# EAGLE board eib-128-256-nanoz-adapter (EAGLE 8.3.2), part 1 of 2
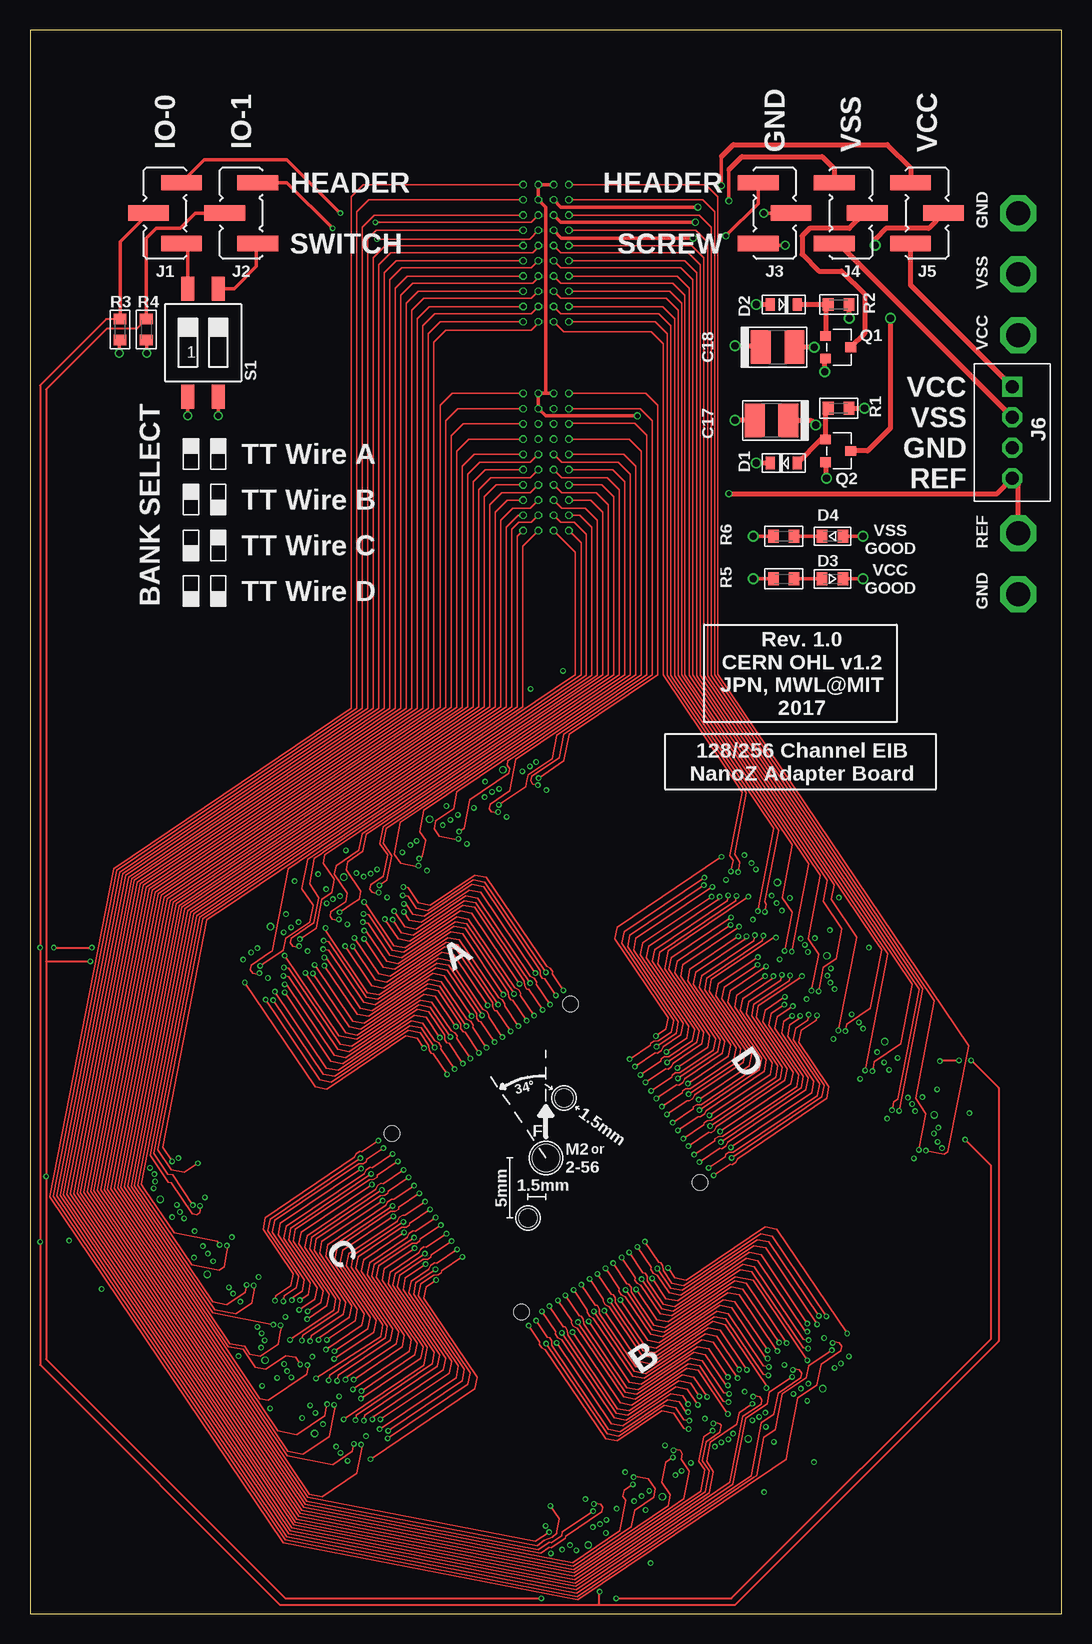
[diagram p5: board, top side]
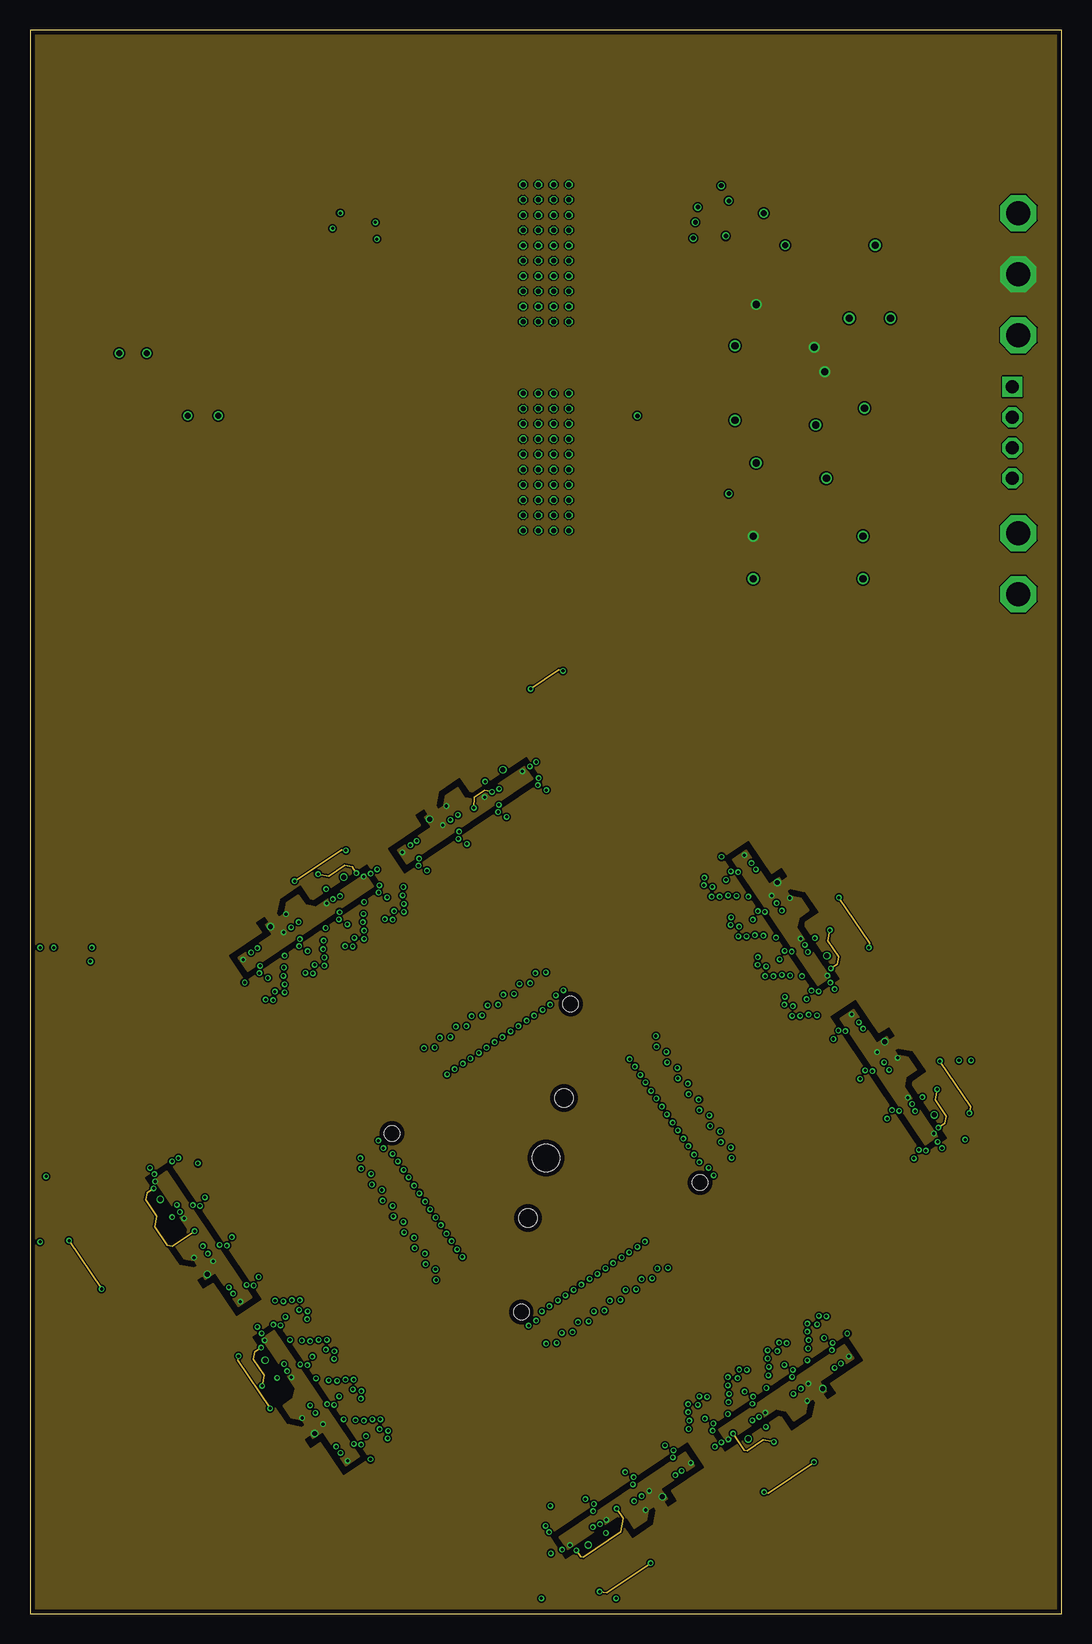
[diagram p6: board, inner layer Route2]
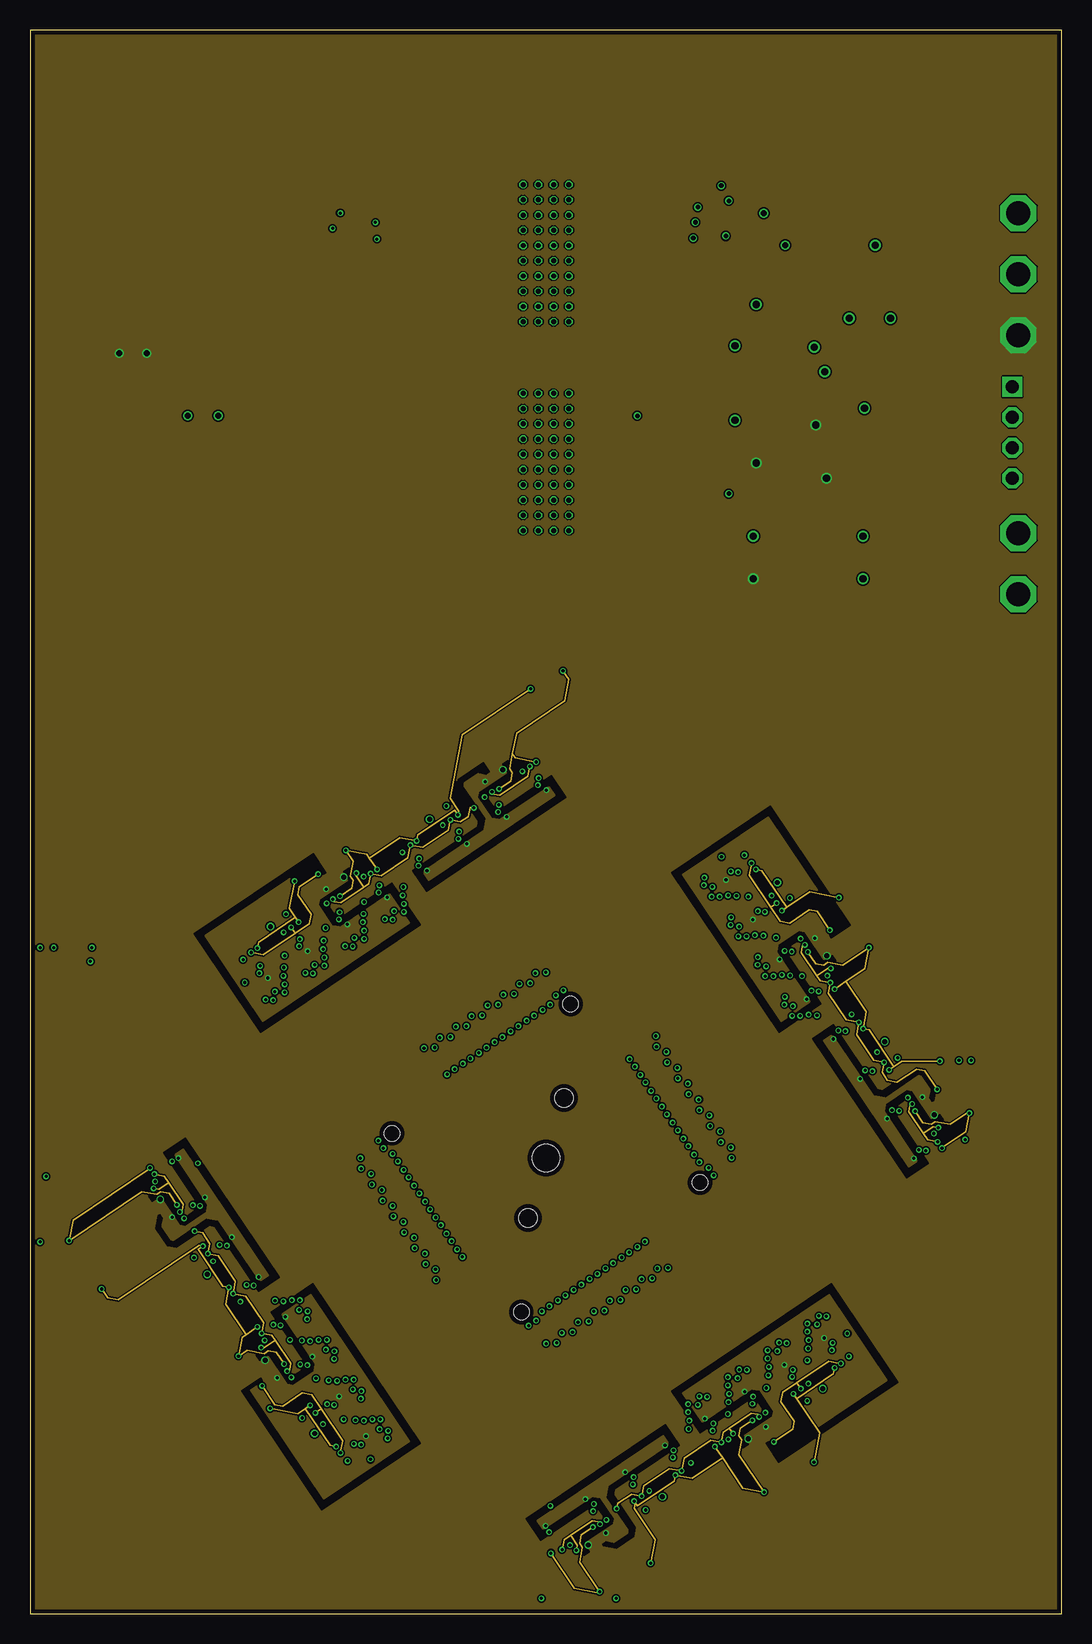
[diagram p7: board, inner layer Route15]
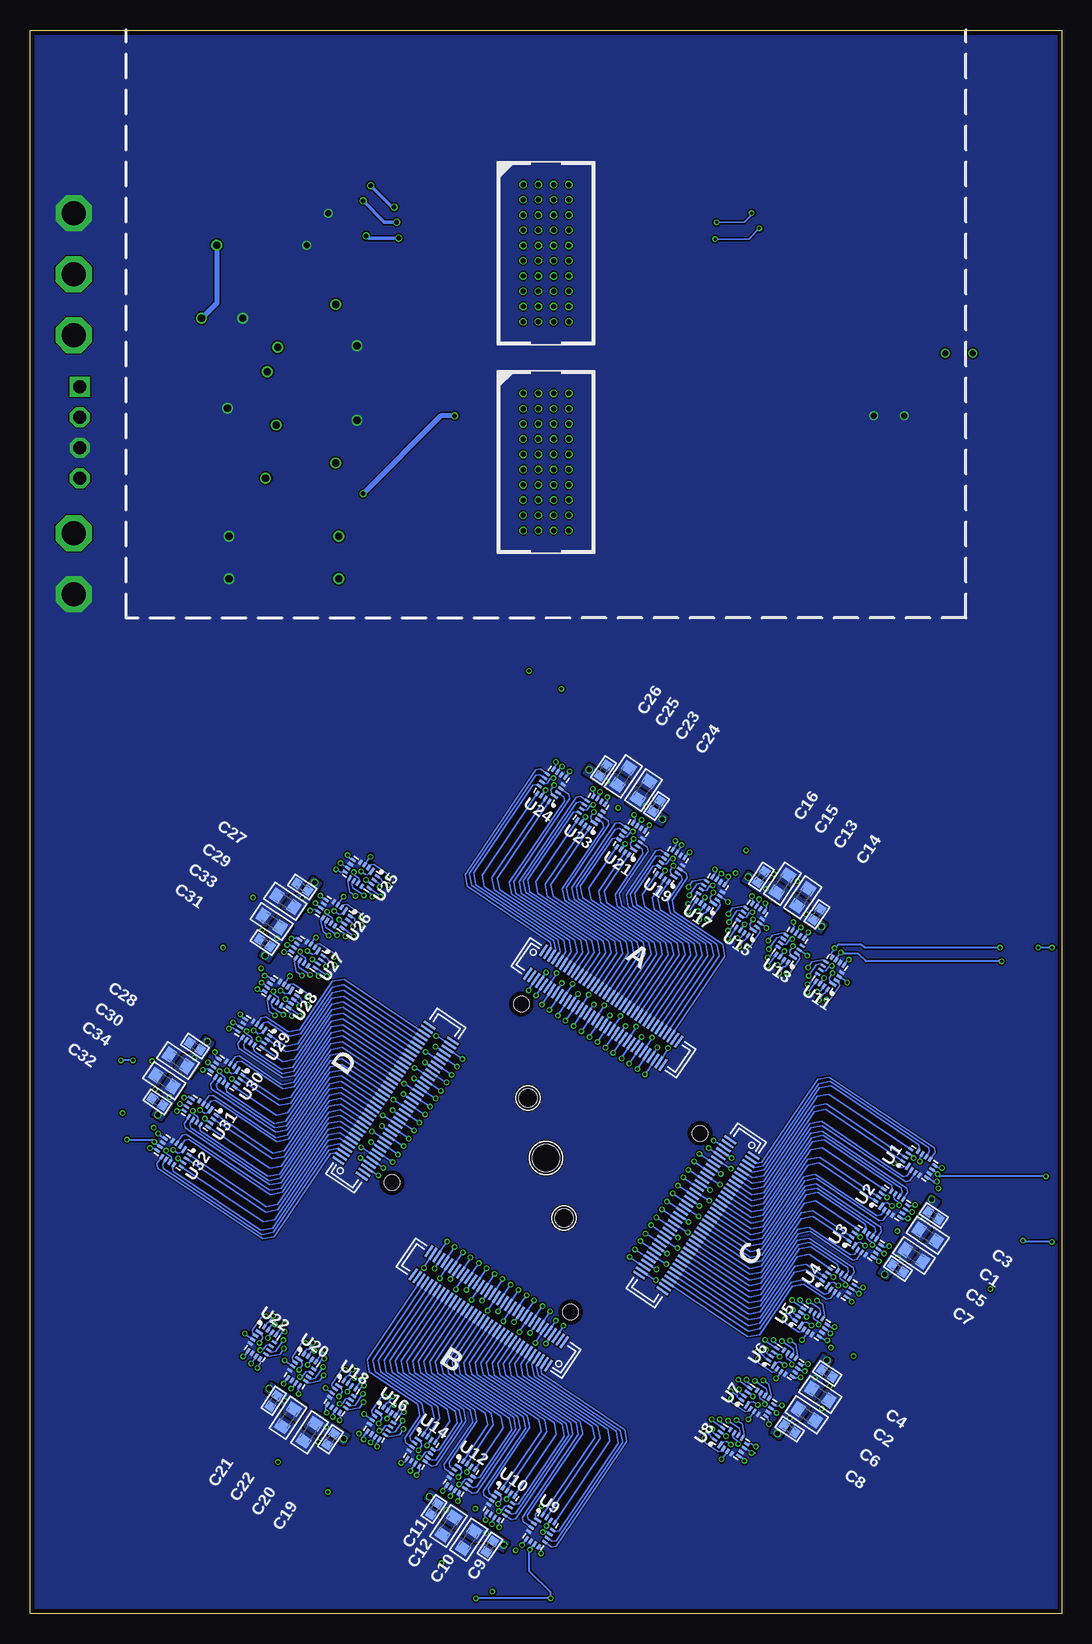
[diagram p8: board, bottom side, seen from below]

Size 86 x 132 mm. Coordinates in mm from the lower left corner, seen from the top.
Outline: 0,0 86,0 86,132 0,132 0,0
Copper layers (1*2*15*16): Top 0.035559375mm / dielectric 0.17018125mm / Route2 0.01778125mm / dielectric 47mil / Route15 0.01778125mm / dielectric 0.17018125mm / Bottom 0.035559375mm
Design rules "ohs-park-4-layer": minimum track width 5mil, minimum drill 10mil, track to track 0.126490625mm, track to pad 0.126490625mm, pad to pad 0.126490625mm, via to via 0.126490625mm, smd to smd 0.126490625mm, copper to edge 15mil, drill to drill 5mil, minimum pad ring 4mil, minimum via ring 4mil, stop-mask expansion 3mil, vias tented up to drill 100mil, thermal gap 10mil
Net classes: 1 thick: width 0.102 mm
Holes 1.27 mm at 45.06,50.85 55.85,35.94 40.94,25.15 30.15,40.06

## Footprints (pad centres in the part's own frame; a part is rotated, then mirrored left to right if it is on the bottom)
DF40-70REC = smd 0.2 x 1.14: 1 -6.8,1.17; 2 -6.4,1.17; 3 -6,1.17; 4 -5.6,1.17; 5 -5.2,1.17; 6 -4.8,1.17; 7 -4.4,1.17; 8 -4,1.17; 9 -3.6,1.17; 10 -3.2,1.17; 11 -2.8,1.17; 12 -2.4,1.17; 13 -2,1.17; 14 -1.6,1.17; 15 -1.2,1.17; 16 -0.8,1.17; 17 -0.4,1.17; 18 0,1.17; 19 0.4,1.17; 20 0.8,1.17; 21 1.2,1.17; 22 1.6,1.17; 23 2,1.17; 24 2.4,1.17; 25 2.8,1.17; 26 3.2,1.17; 27 3.6,1.17; 28 4,1.17; 29 4.4,1.17; 30 4.8,1.17; 31 5.2,1.17; 32 5.6,1.17; 33 6,1.17; 34 6.4,1.17; 35 6.8,1.17; 36 6.8,-1.17; 37 6.4,-1.17; 38 6,-1.17; 39 5.6,-1.17; 40 5.2,-1.17; 41 4.8,-1.17; 42 4.4,-1.17; 43 4,-1.17; 44 3.6,-1.17; 45 3.2,-1.17; 46 2.8,-1.17; 47 2.4,-1.17; 48 2,-1.17; 49 1.6,-1.17; 50 1.2,-1.17; 51 0.8,-1.17; 52 0.4,-1.17; 53 0,-1.17; 54 -0.4,-1.17; 55 -0.8,-1.17; 56 -1.2,-1.17; 57 -1.6,-1.17; 58 -2,-1.17; 59 -2.4,-1.17; 60 -2.8,-1.17; 61 -3.2,-1.17; 62 -3.6,-1.17; 63 -4,-1.17; 64 -4.4,-1.17; 65 -4.8,-1.17; 66 -5.2,-1.17; 67 -5.6,-1.17; 68 -6,-1.17; 69 -6.4,-1.17; 70 -6.8,-1.17
0603 = smd 0.889 x 1.067: 1 -0.864,0; 2 0.864,0
0402 = smd 0.686 x 0.762: 1 -0.533,0; 2 0.533,0
1210-POL = smd 1.651 x 2.794: + -1.397,0; - 1.397,0
SOD-323 = smd 0.762 x 1.016: A -1.118,0; C 1.118,0
LED-0603 = smd 1.067 x 0.889: A 0,-0.864; C 0,0.864
JP3_SMD = smd 1.27 x 3.4: 1 -2.54,1.37; 2 0,-1.37; 3 2.54,1.37
SCREW4 = drill 1.1 square: 1 0,0 | drill 1.1 octagon: 2 2.54,0; 3 5.08,0; 4 7.62,0
MOLC-110-11-S-Q = drill 0.406 octagon: A1 -1.905,5.715; A2 -1.905,4.445; A3 -1.905,3.175; A4 -1.905,1.905; A5 -1.905,0.635; A6 -1.905,-0.635; A7 -1.905,-1.905; A8 -1.905,-3.175; A9 -1.905,-4.445; A10 -1.905,-5.715; B1 -0.635,5.715; B2 -0.635,4.445; B3 -0.635,3.175; B4 -0.635,1.905; B5 -0.635,0.635; B6 -0.635,-0.635; B7 -0.635,-1.905; B8 -0.635,-3.175; B9 -0.635,-4.445; B10 -0.635,-5.715; C1 0.635,5.715; C2 0.635,4.445; C3 0.635,3.175; C4 0.635,1.905; C5 0.635,0.635; C6 0.635,-0.635; C7 0.635,-1.905; C8 0.635,-3.175; C9 0.635,-4.445; C10 0.635,-5.715; D1 1.905,5.715; D2 1.905,4.445; D3 1.905,3.175; D4 1.905,1.905; D5 1.905,0.635; D6 1.905,-0.635; D7 1.905,-1.905; D8 1.905,-3.175; D9 1.905,-4.445; D10 1.905,-5.715
SOT23-GSD = smd 0.8 x 0.9: D 0,0; G -0.95,-2.1; S 0.95,-2.1
SMS-002 = smd 1.092 x 2.007: 1 -1.27,-4.496; 2 1.27,-4.496; 3 1.27,4.496; 4 -1.27,4.496
MQFN16-1.8X2.6 = smd 0.663 x 0.225: 1 -0.7,0.6 | smd 0.463 x 0.225: 2 -0.8,0.2; 3 -0.8,-0.2; 4 -0.8,-0.6; 9 0.8,-0.6; 10 0.8,-0.2; 11 0.8,0.2; 12 0.8,0.6 | smd 0.225 x 0.463: 5 -0.6,-1.2; 6 -0.2,-1.2; 7 0.2,-1.2; 8 0.6,-1.2; 13 0.6,1.2; 14 0.2,1.2; 15 -0.2,1.2; 16 -0.6,1.2
EIB_MOUNT_A = hole 2.261: 0,0 | hole 1.5: 1.5,5; -1.5,-5

## Placement (x,y rotation side)
A  DF40HEAD  [DF40-70REC]  38.23,50.53 326 bottom
B  DF40HEAD  [DF40-70REC]  47.77,25.47 146 bottom
C  DF40HEAD  [DF40-70REC]  30.47,33.23 236 bottom
C1  1uF  [0603]  11.19,31.56 326 bottom
C2  1uF  [0603]  20.14,18.29 326 bottom
C3  0.1uF  [0402]  10.69,33.21 326 bottom
C4  0.1uF  [0402]  19.57,20.05 326 bottom
C5  1uF  [0603]  12.33,29.87 326 bottom
C6  1uF  [0603]  21.28,16.61 326 bottom
C7  0.1uF  [0402]  13.67,28.79 326 bottom
C8  0.1uF  [0402]  22.69,15.42 326 bottom
C9  0.1uF  [0402]  47.68,5.62 236 bottom
C10  1uF  [0603]  49.44,6.19 236 bottom
C11  0.1uF  [0402]  52.32,8.74 236 bottom
C12  1uF  [0603]  51.13,7.33 236 bottom
C13  1uF  [0603]  21.61,59.72 56 bottom
C14  0.1uF  [0402]  20.42,58.31 56 bottom
C15  1uF  [0603]  23.29,60.86 56 bottom
C16  0.1uF  [0402]  25.05,61.43 56 bottom
C17  10uF  [1210-POL]  61.8,99.47 180 top
C18  10uF  [1210-POL]  62.3,105.56 0 top
C19  0.1uF  [0402]  60.95,14.57 236 bottom
C20  1uF  [0603]  62.71,15.14 236 bottom
C21  0.1uF  [0402]  65.69,17.76 236 bottom
C22  1uF  [0603]  64.5,16.35 236 bottom
C23  1uF  [0603]  34.87,68.67 56 bottom
C24  0.1uF  [0402]  33.79,67.33 56 bottom
C25  1uF  [0603]  36.56,69.81 56 bottom
C26  0.1uF  [0402]  38.21,70.31 56 bottom
C27  0.1uF  [0402]  63.31,60.58 146 bottom
C28  0.1uF  [0402]  72.26,47.32 146 bottom
C29  1uF  [0603]  64.72,59.39 146 bottom
C30  1uF  [0603]  73.67,46.13 146 bottom
C31  0.1uF  [0402]  66.43,55.95 146 bottom
C32  0.1uF  [0402]  75.38,42.68 146 bottom
C33  1uF  [0603]  65.86,57.71 146 bottom
C34  1uF  [0603]  74.81,44.44 146 bottom
D  DF40HEAD  [DF40-70REC]  55.53,42.77 56 bottom
D1  MMSZ5240BS  [SOD-323]  62.81,95.91 180 top
D2  MMSZ5240BS  [SOD-323]  62.81,109.12 0 top
D3  [LED-0603]  66.88,86.26 270 top
D4  [LED-0603]  66.88,89.82 90 top
J1  [JP3_SMD]  11.25,116.74 270 top
J2  [JP3_SMD]  17.6,116.74 270 top
J3  [JP3_SMD]  62.05,116.74 90 top
J4  [JP3_SMD]  68.4,116.74 90 top
J5  [JP3_SMD]  74.75,116.74 90 top
J6  [SCREW4]  81.86,102.26 270 top
J7  [MOLC-110-11-S-Q]  43,113.4 0 bottom
J8  [MOLC-110-11-S-Q]  43,96 0 bottom
Q1  DMN3404L  [SOT23-GSD]  68.4,105.56 270 top
Q2  DMP3056L  [SOT23-GSD]  68.4,96.93 270 top
R1  1k  [0603]  67.38,100.48 180 top
R2  1k  [0603]  67.38,109.12 0 top
R3  10k  [0603]  7.51,107.04 270 top
R4  10k  [0603]  9.7,107.04 270 top
R5  1k  [0603]  62.81,86.26 180 top
R6  1k  [0603]  62.81,89.82 0 top
S1  219-2MSTR  [SMS-002]  14.43,105.94 0 top
U1  DG4052A  [MQFN16-1.8X2.6]  11.94,37.55 56 bottom
U2  DG4052A  [MQFN16-1.8X2.6]  14.18,34.24 56 bottom
U3  DG4052A  [MQFN16-1.8X2.6]  16.41,30.92 56 bottom
U4  DG4052A  [MQFN16-1.8X2.6]  18.65,27.61 56 bottom
U5  DG4052A  [MQFN16-1.8X2.6]  20.89,24.29 56 bottom
U6  DG4052A  [MQFN16-1.8X2.6]  23.12,20.97 56 bottom
U7  DG4052A  [MQFN16-1.8X2.6]  25.36,17.66 56 bottom
U8  DG4052A  [MQFN16-1.8X2.6]  27.6,14.34 56 bottom
U9  DG4052A  [MQFN16-1.8X2.6]  43.45,6.94 326 bottom
U10  DG4052A  [MQFN16-1.8X2.6]  46.76,9.18 326 bottom
U11  DG4052A  [MQFN16-1.8X2.6]  19.34,53.4 146 bottom
U12  DG4052A  [MQFN16-1.8X2.6]  50.08,11.41 326 bottom
U13  DG4052A  [MQFN16-1.8X2.6]  22.66,55.64 146 bottom
U14  DG4052A  [MQFN16-1.8X2.6]  53.39,13.65 326 bottom
U15  DG4052A  [MQFN16-1.8X2.6]  25.97,57.88 146 bottom
U16  DG4052A  [MQFN16-1.8X2.6]  56.71,15.89 326 bottom
U17  DG4052A  [MQFN16-1.8X2.6]  29.29,60.11 146 bottom
U18  DG4052A  [MQFN16-1.8X2.6]  60.03,18.12 326 bottom
U19  DG4052A  [MQFN16-1.8X2.6]  32.61,62.35 146 bottom
U20  DG4052A  [MQFN16-1.8X2.6]  63.34,20.36 326 bottom
U21  DG4052A  [MQFN16-1.8X2.6]  35.92,64.59 146 bottom
U22  DG4052A  [MQFN16-1.8X2.6]  66.66,22.6 326 bottom
U23  DG4052A  [MQFN16-1.8X2.6]  39.24,66.82 146 bottom
U24  DG4052A  [MQFN16-1.8X2.6]  42.55,69.06 146 bottom
U25  DG4052A  [MQFN16-1.8X2.6]  58.4,61.66 236 bottom
U26  DG4052A  [MQFN16-1.8X2.6]  60.64,58.34 236 bottom
U27  DG4052A  [MQFN16-1.8X2.6]  62.88,55.03 236 bottom
U28  DG4052A  [MQFN16-1.8X2.6]  65.11,51.71 236 bottom
U29  DG4052A  [MQFN16-1.8X2.6]  67.35,48.39 236 bottom
U30  DG4052A  [MQFN16-1.8X2.6]  69.59,45.08 236 bottom
U31  DG4052A  [MQFN16-1.8X2.6]  71.82,41.76 236 bottom
U32  DG4052A  [MQFN16-1.8X2.6]  74.06,38.45 236 bottom
U$1  [EIB_MOUNT_A]  43,38 0 top

## Tracks (layer width: path | path; a pad name or v marks a point on that pad's centre or on a via)
A  (via drill 0.25)
  Top 0.178: 7.43,107.98 R3.1 6.35,107.9 0.84,102.39 v0.84,55.53 v0.84,31.01 0.84,20.75 20.8,0.79 47.44,0.79 | 47.44,0.79 58.77,0.79 80.72,22.74 80.72,43.84 v78.43,46.13 | v75.82,46.07 75.87,46.13 v77.42,46.13 | v1.98,55.53 v5.15,55.53 | 47.44,0.79 47.44,1.86 v47.47,1.86 | 47.44,0.79 | 47.44,0.79
  Top 0.305: J1.2 7.51,114.37 R3.1
  Route2 0.127: v22.05,61.06 25.97,63.71 v26.32,63.64 | v3.25,31.11 v5.97,27.08 | v20.01,17.13 17.31,21.13 v17.38,21.48 | v41.72,77.09 44.06,78.67 v44.41,78.6 | v61.17,10.15 61.52,10.08 v65.33,12.65 | v75.82,46.07 78.39,42.26 v78.29,41.73 | v67.4,59.69 69.97,55.88 v69.9,55.53 | v51.71,4.23 48.07,1.78 v47.47,1.86 | v78.29,41.73 | v61.17,10.15 | v65.33,12.65
  Route15 0.127: v62.65,58.61 63.05,58.88 | v60.48,62.05 60.98,61.95 63.05,58.88 | v64.82,55.17 65.46,54.21 66.15,54.07 66.49,54.3 67.72,54.06 v69.9,55.53 69.56,53.77 68,52.72 | v71.6,45.34 72,45.61 | 72,45.61 69.92,48.69 v69.43,48.78 | 72,45.61 72.65,46.05 v75.82,46.07 | v73.76,41.9 74.41,40.94 75.1,40.81 75.44,41.04 76.67,40.8 78.11,41.77 v78.29,41.73 77.99,40.19 | v76,38.81 75.98,38.83 77.25,39.69 77.99,40.19 | 68,52.72 v67.05,52.08 | v69.43,48.78 69.7,50.19 68,52.72 | v69.43,48.78 | v23.35,17.39 22.95,17.12 | v25.52,13.95 25.02,14.05 22.95,17.12 | 22.95,17.12 22.3,16.68 v20.01,17.13 | v21.18,20.83 20.54,21.79 19.85,21.93 19.51,21.7 18.1,21.97 v17.38,21.48 17.68,23.07 18,23.28 | v12.24,34.1 11.59,35.06 10.9,35.19 10.56,34.96 9.33,35.2 v3.25,31.11 v3.26,31.1 3.59,32.83 10.01,37.16 v10,37.19 | 18,23.28 v18.95,23.92 | v16.57,27.22 16.3,25.81 18,23.28 | v16.57,27.22 16.08,27.31 14,30.39 v14.4,30.66 14.08,30.72 7.35,26.18 6.46,26.35 v5.97,27.08 | v16.57,27.22 | v22.39,57.65 22.12,58.05 | v18.95,55.48 19.05,55.98 22.12,58.05 | 22.12,58.05 21.61,58.81 v22.05,61.06 | v25.83,59.82 26.79,60.46 26.93,61.15 26.7,61.49 26.94,62.72 v26.32,63.64 28.08,63.29 28.28,63 | v39.1,68.76 40.06,69.41 40.19,70.1 39.96,70.44 40.2,71.67 | 28.28,63 v28.92,62.05 | v32.22,64.43 30.81,64.7 28.28,63 | v32.22,64.43 32.31,64.92 35.39,67 v35.66,66.6 35.72,66.92 35.01,67.97 36.04,73.26 v41.72,77.09 | v32.22,64.43 | v63.61,18.35 63.88,17.95 | v67.05,20.52 66.95,20.02 63.88,17.95 | v60.19,16.14 59.19,15.47 59.07,14.85 59.3,14.51 59.06,13.28 v61.17,10.15 59.41,10.49 57.72,13 | v46.9,7.24 45.94,6.59 45.81,5.9 46.04,5.56 45.8,4.33 47.43,1.9 v47.47,1.86 47.27,1.78 45.37,2.15 v43.4,5.06
  Route15 0.127: 57.72,13 v57.08,13.95 | v53.78,11.57 55.19,11.3 57.72,13 | v53.78,11.57 53.69,11.08 50.61,9 v50.34,9.4 50.43,9.28 50.34,8.82 52.1,6.21 v51.71,4.23 | v53.78,11.57 | 40.2,71.67 40.54,73.41 44.55,76.12 44.9,77.88 v44.41,78.6 | 40.2,71.67 40.43,71.34 v42.19,71 | 63.88,17.95 65.81,15.09 v65.33,12.65 | 63.05,58.88 64.96,60.17 v67.4,59.69 | 77.99,40.19
  Bottom 0.127: U25.8 60.07,61.77 v60.48,62.05 | U26.8 62.27,58.72 v62.65,58.61 | U27.8 64.31,55.27 64.32,55.26 v64.82,55.17 | U28.8 66.69,51.84 v67.05,52.08 | U32.8 75.75,38.86 v76,38.81 | U31.8 73.25,42 v73.76,41.9 | U30.8 71.17,45.42 v71.6,45.34 | U29.8 69.1,48.85 v69.43,48.78 | U12.8 50.17,9.66 v50.34,9.4 | U10.8 46.84,7.33 v46.9,7.24 | U14.8 53.5,11.99 v53.78,11.57 | U18.8 60.1,16.28 v60.19,16.14 | U16.8 57.13,14.19 v57.08,13.95 | U20.8 63.69,18.77 v63.61,18.35 | U7.8 23.77,17.31 v23.35,17.39 | U6.8 21.69,20.73 v21.18,20.83 | U5.8 19.19,23.87 v18.95,23.92 | U4.8 16.9,27.15 v16.57,27.22 | U3.8 14.83,30.58 v14.4,30.66 | U2.8 12.75,34 v12.24,34.1 | U1.8 10.25,37.14 v10,37.19 | U13.8 22.31,57.23 v22.39,57.65 | U15.8 25.73,59.31 v25.83,59.82 | U17.8 28.87,61.8 v28.92,62.05 | U19.8 32.15,64.1 v32.22,64.43 | U21.8 35.58,66.17 v35.66,66.6 | U23.8 39,68.25 v39.1,68.76 | U24.8 42.14,70.75 v42.19,71 | U22.8 66.77,20.93 v67.05,20.52 | U11.8 19.23,55.07 v18.95,55.48 | U8.8 25.93,14.23 v25.52,13.95 | U9.8 43.49,5.52 v43.4,5.06
  Bottom 0.178: v77.42,46.13 v78.43,46.13 | v0.84,31.01 3.16,31.01 v3.25,31.11 | v0.84,55.53 v1.98,55.53 | v5.15,55.53 16.46,55.53 16.71,55.78 18.65,55.78 v18.95,55.48
B  (via drill 0.25)
  Top 0.178: R4.1 8.88,107.09 6.39,107.09 1.34,102.05 1.34,54.38 | 1.34,54.38 v1.34,36.48 1.34,21.24 21.29,1.3 v42.62,1.3 | v48.84,1.3 58.44,1.3 80.08,22.94 80.08,37.36 v77.92,39.52 | 1.34,54.38 v5.03,54.38
  Top 0.305: J2.2 13.79,116.74 12.52,115.47 10.53,115.47 9.7,114.64 R4.1
  Route2 0.127: v66.65,56.99 66.48,56.1 67.39,54.76 67.27,54.16 v66.75,53.8 | v75.6,43.72 75.43,42.84 76.34,41.49 76.22,40.89 v75.69,40.54 | v19.35,19.01 19.52,19.89 18.61,21.24 18.73,21.84 v19.25,22.2 | v10.31,35.46 9.78,35.11 9.66,34.51 10.57,33.16 10.4,32.28 11.45,30.72 11.84,30.65 v13.72,31.91 | v24.01,61.65 24.89,61.48 26.24,62.39 26.84,62.27 v27.2,61.75 | v61.99,14.35 61.1,14.52 59.76,13.61 59.51,13.66 v58.59,15.03 | v36.98,67.18 37.04,68.05 37.9,68.63 v38.5,68.51 | v48.88,8.79 49.44,7.97 49.22,6.84 46.1,4.74 45.89,4.78 v45.54,5.31 | v45.54,5.31
  Route15 0.127: v60.13,62.57 59.93,61.55 61.72,58.9 | 61.72,58.9 62.5,57.73 63.3,57.58 64.93,58.67 65.6,58.54 v66.65,56.99 | 65.58,53.17 65.85,52.77 v66.7,52.6 66.53,51.72 68.02,49.51 v69.07,49.31 | 65.58,53.17 64.27,55.12 64.36,55.63 v64.57,55.76 | v69.07,49.31 68.87,48.29 70.32,46.14 v71.17,45.97 71.01,45.13 71.45,44.47 72.25,44.31 73.88,45.41 74.55,45.28 v75.6,43.72 | v75.64,39.34 74.8,39.5 74.43,40.05 | 74.43,40.05 73.21,41.85 73.31,42.36 v73.51,42.5 | v62.22,59.24 61.72,58.9 | v69.07,49.31 | 65.58,53.17 66.57,53.84 v66.75,53.8 | v75.69,40.54 75.27,40.62 74.43,40.05 | v25.87,13.43 26.07,14.45 24.28,17.1 | 24.28,17.1 23.5,18.27 22.7,18.42 21.07,17.33 20.4,17.46 v19.35,19.01 | 20.42,22.83 20.15,23.23 v19.3,23.39 19.47,24.28 17.98,26.49 v16.92,26.69 v16.93,26.69 | 20.42,22.83 21.73,20.88 21.63,20.37 v21.43,20.24 | v16.93,26.69 17.12,27.71 15.68,29.86 v14.83,30.03 14.99,30.87 14.38,31.79 v13.72,31.91 | v10.36,36.66 11.2,36.49 11.57,35.95 | 11.57,35.95 12.79,34.14 12.69,33.64 v12.49,33.5 | v23.78,16.76 24.28,17.1 | v16.93,26.69 | 20.42,22.83 19.43,22.16 v19.25,22.2 | v10.31,35.46 10.73,35.38 11.57,35.95 | v18.43,55.13 19.45,54.93 22.1,56.72 | 22.1,56.72 23.27,57.5 23.42,58.3 22.33,59.93 22.46,60.6 v24.01,61.65 | 27.83,60.58 28.23,60.85 v28.39,61.7 29.28,61.53 31.49,63.02 v31.69,64.07 | 27.83,60.58 25.88,59.27 25.37,59.36 v25.24,59.57 | v31.69,64.07 32.71,63.87 34.86,65.32 v35.03,66.17 35.87,66.01 36.53,66.45 36.69,67.25 36.7,67.24 v36.98,67.18 | v41.66,70.64 41.49,69.8 39.14,68.21 38.64,68.31 v38.5,68.51 | v21.76,57.22 22.1,56.72 | v31.69,64.07 | 27.83,60.58 27.16,61.57 v27.2,61.75
  Route15 0.127: v67.57,20.87 66.55,21.07 63.9,19.28 | 63.9,19.28 62.73,18.5 62.58,17.7 63.67,16.07 63.54,15.4 v61.99,14.35 | 58.27,15.49 57.77,15.15 v57.6,14.3 56.72,14.47 54.51,12.98 v54.31,11.92 v54.31,11.93 | 58.27,15.49 60.12,16.73 60.63,16.63 v60.76,16.43 | v54.31,11.93 53.29,12.12 51.14,10.68 v50.97,9.83 50.13,9.99 48.97,9.21 v48.88,8.79 | v44.34,5.36 44.5,6.2 45.05,6.57 | 45.05,6.57 46.85,7.79 47.36,7.69 v47.5,7.49 | v64.24,18.78 63.9,19.28 | v54.31,11.93 | 58.27,15.49 v58.59,15.03 | 45.05,6.57 45.62,5.73 45.57,5.48 v45.54,5.31
  Bottom 0.127: U25.7 v60.13,62.57 | U26.7 62.26,59.19 v62.22,59.24 | U27.7 64.49,55.87 v64.57,55.76 | U28.7 66.3,52.34 v66.7,52.6 | U32.7 75.63,39.26 v75.64,39.34 | U31.7 73.33,42.53 v73.51,42.5 | U30.7 71.15,45.89 v71.17,45.97 | U29.7 v69.07,49.31 | U12.7 50.66,10.29 v50.97,9.83 | U10.7 47.53,7.67 v47.5,7.49 | U9.7 44.03,5.82 v44.34,5.36 | U14.7 v54.31,11.93 | U18.7 60.8,16.62 v60.76,16.43 | U16.7 57.53,14.32 v57.6,14.3 | U20.7 64.16,18.79 v64.24,18.78 | U7.7 23.79,16.84 v23.78,16.76 | U6.7 21.62,20.2 v21.43,20.24 | U5.7 19.32,23.47 v19.3,23.39 | U4.7 v16.93,26.69 | U3.7 14.85,30.11 v14.83,30.03 | U2.7 12.67,33.46 v12.49,33.5 | U1.7 10.37,36.74 v10.36,36.66 | U13.7 21.84,57.21 v21.76,57.22 | U15.7 25.2,59.38 v25.24,59.57 | U17.7 28.47,61.68 v28.39,61.7 | U19.7 v31.69,64.07 | U21.7 35.11,66.15 v35.03,66.17 | U23.7 38.46,68.33 v38.5,68.51 | U24.7 41.74,70.63 v41.66,70.64 | U22.7 v67.57,20.87 | U11.7 v18.43,55.13 | U8.7 v25.87,13.43
  Bottom 0.178: v25.87,13.43 25.6,13.43 | v1.34,36.48 10.17,36.48 v10.36,36.66 | v48.84,1.3 v42.62,1.3 42.62,1.8 44.4,3.58 44.4,5.3 v44.34,5.36 | v5.03,54.38 16.33,54.38 16.96,55.02 18.32,55.02 v18.43,55.13 | v77.92,39.52 75.83,39.52 v75.64,39.34
GND  (via drill 0.5, 0.6, 2)
  Top 0.305: S1.1 v13.15,99.85 | S1.2 v15.69,99.85 | J3.1 60.81,114.07 v62.94,114.07 | v61.16,116.74 J3.2 | 60.78,105.69 C18.+ | D3.C v69.42,86.26 | v69.42,89.82 D4.A
  Top 0.406: v58.75,105.69 60.78,105.69 | C17.- v58.75,99.47 | R1.1 v69.54,100.48 | R2.2 68.25,108 v68.27,107.98
  Bottom 0.406: 10.35,30.99 C1.2 | C5.2 11.49,29.3 | 35.99,70.65 C25.2 | C23.2 34.3,69.51
  other vias: 82.37,84.99 82.37,116.74
  pour Bottom (rank 3, no thermals): -1,134 87,134 87,-2 -1,-2
GND_HEAD  (via drill 0.38)
  Top 0.305: J7.B4 44.29,114.66 v55.27,114.66 | v57.99,114.83 60.68,117.53 J3.3
  Bottom 0.305: v55.27,114.66 57.81,114.66 v57.99,114.83
GPIO0_HEAD  (via drill 0.25)
  Top 0.127: J7.C3 41.76,115.98 v28.78,115.98
  Top 0.305: J1.1 14.52,121.18 21.41,121.18 v25.85,116.74
  Bottom 0.127: v28.78,115.98 26.49,115.98 25.85,116.61 v25.85,116.74
GPIO1_HEAD  (via drill 0.25)
  Top 0.127: J7.C4 41.64,114.58 v28.9,114.58
  Top 0.305: J2.1 21.41,119.28 v25.22,115.47
  Bottom 0.127: v28.9,114.58 26.11,114.58 v25.22,115.47
N$65
  Bottom 0.127: C.2 25.45,37.56 25.01,37.64 20.35,44.55 19.38,44.74 10.65,38.85 10.58,38.5 U1.9
N$66
  Bottom 0.127: C.3 25.63,37.2 24.91,37.34 20.28,44.2 19.31,44.39 11.12,38.86 11.05,38.51 U1.10
N$67
  Bottom 0.127: C.4 25.79,36.83 24.82,37.01 20.21,43.85 19.24,44.03 11.93,39.1 11.86,38.75 U1.12
N$68
  Bottom 0.127: C.5 25.81,36.35 24.83,36.54 20.39,43.13 19.42,43.32 U1.13
N$69
  Bottom 0.127: C.6 25.82,35.88 24.85,36.07 20.62,42.33 19.65,42.52 U1.15
N$70
  Bottom 0.127: C.7 25.83,35.4 24.86,35.59 20.64,41.85 19.67,42.04 U1.16
N$71
  Bottom 0.127: C.8 25.85,34.93 24.87,35.12 21.01,40.86 20.03,41.04 13.23,36.45 12.88,36.52 U1.2
N$72
  Bottom 0.127: C.9 25.86,34.46 24.89,34.65 20.94,40.5 19.96,40.69 13.04,36.02 12.69,36.09 U1.3
N$73
  Bottom 0.127: C.10 25.87,33.98 24.9,34.17 20.94,40.05 19.97,40.23 12.92,35.48 12.85,35.13 U2.9
N$74
  Bottom 0.127: C.11 25.89,33.51 24.91,33.7 20.87,39.69 19.9,39.88 13.39,35.49 13.32,35.14 U2.10
N$75
  Bottom 0.127: C.12 25.9,33.04 24.93,33.22 20.8,39.34 19.83,39.53 14.2,35.73 14.13,35.38 U2.12
N$76
  Bottom 0.127: C.13 25.91,32.56 24.94,32.75 20.94,38.68 19.97,38.87 U2.13
N$77
  Bottom 0.127: C.14 25.92,32.09 24.95,32.28 21.18,37.88 20.21,38.06 U2.15
N$78
  Bottom 0.127: C.15 25.94,31.62 24.97,31.8 21.19,37.4 20.22,37.59 U2.16
N$79
  Bottom 0.127: C.16 25.95,31.14 24.98,31.33 21.52,36.46 20.55,36.64 15.43,33.19 15.08,33.26 U2.2
N$80
  Bottom 0.127: C.17 25.96,30.67 24.99,30.86 21.45,36.1 20.48,36.29 15.24,32.76 14.89,32.82 U2.3
N$81
  Bottom 0.127: C.18 25.98,30.19 25.01,30.38 21.46,35.65 20.48,35.83 15.12,32.22 15.05,31.86 U3.9
N$82
  Bottom 0.127: C.19 25.99,29.72 25.02,29.91 21.39,35.29 20.42,35.48 15.59,32.23 15.53,31.88 U3.10
N$83
  Bottom 0.127: C.20 26,29.25 25.03,29.44 21.32,34.94 20.35,35.13 16.4,32.47 16.33,32.11 16.33,32.05 U3.12
N$84
  Bottom 0.127: C.21 26.02,28.77 25.04,28.96 21.49,34.23 20.52,34.42 U3.13
N$85
  Bottom 0.127: C.22 26.03,28.3 25.06,28.49 21.73,33.42 20.76,33.61 U3.15
N$86
  Bottom 0.127: C.23 26.04,27.83 25.07,28.01 21.74,32.95 20.77,33.14 U3.16
N$87
  Bottom 0.127: C.24 26.06,27.35 25.08,27.54 22.04,32.06 21.07,32.24 17.63,29.93 17.28,29.99 U3.2
N$88
  Bottom 0.127: C.25 26.07,26.88 25.1,27.07 21.97,31.7 21,31.89 17.44,29.49 17.09,29.56 U3.3
N$89
  Bottom 0.127: C.26 26.08,26.41 25.11,26.59 22.04,31.14 21.07,31.33 17.39,28.85 17.33,28.49 U4.9
N$90
  Bottom 0.127: C.27 26.09,25.93 25.12,26.12 21.98,30.79 21,30.98 17.87,28.86 17.8,28.51 U4.10
N$91
  Bottom 0.127: C.28 26.11,25.46 25.14,25.65 21.91,30.43 20.94,30.62 18.67,29.1 18.6,28.74 U4.12
N$92
  Bottom 0.127: C.29 26.12,24.98 25.15,25.17 22.04,29.78 21.07,29.96 U4.13
N$93
  Bottom 0.127: C.30 26.13,24.51 25.16,24.7 22.28,28.97 21.31,29.16 U4.15
N$94
  Bottom 0.127: C.31 26.15,24.04 25.18,24.23 22.29,28.5 21.32,28.69 U4.16
N$95
  Bottom 0.127: C.32 26.16,23.56 25.19,23.75 22.56,27.66 21.58,27.84 19.83,26.66 19.48,26.73 U4.2
N$96
  Bottom 0.127: C.33 26.17,23.09 25.2,23.28 22.49,27.3 21.52,27.49 19.64,26.23 19.29,26.3 U4.3 19.2,26.43
N$97  (via drill 0.25)
  Top 0.127: v32.96,29.15 31.28,28.01 31.09,27.04 35.13,21.05 34.94,20.08 v29.2,16.21
  Bottom 0.127: C.41 32.98,29.13 v32.96,29.15 | U8.13 29.02,16.03 v29.2,16.21
N$98  (via drill 0.25)
  Top 0.127: v28.53,16.21 28.56,16.39 34.45,20.36 34.63,21.33 30.62,27.28 30.81,28.25 32.76,29.56 33.14,29.57 33.4,29.75 33.43,29.92 v35.13,31.07
  Bottom 0.127: U8.12 27.67,15.49 28.49,16.04 v28.53,16.21 | C.42 v35.14,31.07 v35.13,31.07
N$99  (via drill 0.25)
  Top 0.127: v32.9,30.03 30.43,28.36 30.24,27.39 34.14,21.61 33.95,20.64 27.91,16.57 v27.82,16.11
  Bottom 0.127: C.43 32.9,30.04 v32.9,30.03 | v27.82,16.11 26.88,15.47 26.82,15.14 U8.10
N$100  (via drill 0.25)
  Top 0.127: v34.71,31.7 33.01,30.56 32.83,30.59 32.57,30.41 32.4,30.09 30.04,28.49 29.85,27.52 33.7,21.81 33.51,20.83 27.21,16.58 v27.13,16.16
  Bottom 0.127: C.44 34.69,31.73 v34.71,31.7 | v27.13,16.16 26.66,15.85 26.48,14.92 U8.9
N$101  (via drill 0.25)
  Top 0.127: v32.06,30.48 29.53,28.78 29.35,27.81 33.12,22.22 32.83,20.72 v26.14,16.21
  Bottom 0.127: C.45 32.11,30.47 v32.06,30.48 | U7.3 26.09,16.22 v26.14,16.21
N$102  (via drill 0.25)
  Top 0.127: v34.23,32.41 32.53,31.26 32.5,31.09 32.23,30.91 31.86,30.9 29.06,29.01 28.87,28.06 32.76,22.29 32.57,21.32 v27.57,17.94
  Bottom 0.127: C.46 34.23,32.38 v34.23,32.41 | U7.2 25.99,17.12 26.14,16.89 26.39,16.84 27.51,17.59 v27.57,17.94
N$103  (via drill 0.25)
  Top 0.127: v32,31.36 28.69,29.13 28.5,28.16 32.27,22.57 32.08,21.6 v27.61,18.58
  Bottom 0.127: C.47 32.06,31.4 v32,31.36 | v27.61,18.58 27.08,18.22 27.05,18.07 U7.16
N$104  (via drill 0.25)
  Top 0.127: v33.81,33.04 32.11,31.89 31.93,31.93 31.61,31.71 31.45,31.39 28.29,29.26 28.1,28.29 31.77,22.85 31.58,21.88 v26.9,18.72
  Bottom 0.127: C.48 33.8,33.06 v33.81,33.04 | U7.15 26.84,18.42 v26.9,18.72
N$106
  Bottom 0.127: 42.88,55.08 42.56,55.55 42.64,55.99 49.55,60.65 49.74,61.62 43.85,70.35 43.5,70.42 42.88,70.01
N$107
  Bottom 0.127: 42.55,54.85 42.2,55.37 42.34,56.09 49.2,60.72 49.39,61.69 43.86,69.88 43.51,69.95 43.11,69.67
N$108
  Bottom 0.127: 42.21,54.63 41.83,55.21 42.01,56.18 48.85,60.78 49.03,61.76 44.1,69.07 43.75,69.14 43.55,69.01
N$109
  Bottom 0.127: 41.88,54.41 41.35,55.19 41.54,56.16 48.13,60.61 48.32,61.58 43.72,68.4
N$110  (via drill 0.25)
  Top 0.127: v31.17,31.8 27.8,29.53 27.62,28.56 31.21,23.23 31.02,22.26 v26.97,19.53
  Bottom 0.127: C.49 31.19,31.78 v31.17,31.8 | U7.13 26.78,19.34 v26.97,19.53
N$111
  Bottom 0.127: 41.55,54.18 40.88,55.18 41.07,56.15 47.33,60.37 47.52,61.35 43.06,67.95
N$118  (via drill 0.25)
  Top 0.127: v33.85,27.83 33.01,27.26 32.82,26.29 37.25,19.72 37.06,18.75 v28.38,12.9
  Bottom 0.127: C.37 33.9,27.82 v33.85,27.83 | U8.3 28.32,12.91 v28.38,12.9
N$119  (via drill 0.25)
  Top 0.127: v36.02,29.76 34.32,28.61 34.29,28.43 34.02,28.25 33.65,28.25 32.54,27.5 32.35,26.53 36.68,20.11 36.49,19.14 v29.81,14.63
  Bottom 0.127: C.38 36.02,29.73 v36.02,29.76 | U8.2 28.22,13.8 28.38,13.57 28.63,13.52 29.74,14.28 v29.81,14.63
N$120  (via drill 0.25)
  Top 0.127: v33.79,28.71 32.16,27.61 31.97,26.64 36.19,20.39 36,19.42 v29.84,15.26
  Bottom 0.127: C.39 33.85,28.75 v33.79,28.71 | v29.84,15.26 29.32,14.91 29.29,14.76 U8.16
N$121  (via drill 0.25)
  Top 0.127: v35.6,30.39 33.9,29.24 33.72,29.27 33.4,29.06 33.24,28.74 31.77,27.74 31.58,26.77 35.69,20.67 35.51,19.7 v29.14,15.4
  Bottom 0.127: C.40 35.59,30.4 v35.6,30.39 | U8.15 29.08,15.1 v29.14,15.4
N$122  (via drill 0.25)
  Top 0.127: v33.34,33.72 31.64,32.58 31.61,32.4 31.35,32.22 30.97,32.21 27.34,29.77 27.15,28.79 30.71,23.51 30.52,22.54 26.32,19.71 v26.29,19.53
  Bottom 0.127: C.50 v33.35,33.72 v33.34,33.72 | 25.39,18.68 U7.12 25.44,18.8 26.26,19.35 v26.29,19.53
N$123  (via drill 0.25)
  Top 0.127: v31.12,32.68 26.96,29.88 26.77,28.9 30.22,23.79 30.03,22.82 25.68,19.88 v25.59,19.42
  Bottom 0.127: C.51 v31.11,32.69 v31.12,32.68 | v25.59,19.42 24.65,18.79 24.58,18.45 U7.10
N$124  (via drill 0.25)
  Top 0.127: v32.92,34.36 31.22,33.21 31.04,33.24 30.78,33.07 30.61,32.74 26.56,30.01 26.37,29.04 29.78,23.98 29.59,23.01 24.97,19.9 v24.89,19.47
  Bottom 0.127: C.52 32.9,34.38 v32.92,34.36 | v24.89,19.47 24.43,19.16 24.25,18.23 U7.9
N$125  (via drill 0.25)
  Top 0.127: v30.27,33.14 26.06,30.3 25.87,29.33 29.41,24.08 29.22,23.11 v23.83,19.63
  Bottom 0.127: C.53 30.32,33.13 v30.27,33.14 | U6.3 23.78,19.64 v23.83,19.63
N$126  (via drill 0.25)
  Top 0.127: v32.44,35.06 30.74,33.91 30.71,33.74 30.44,33.56 30.07,33.55 25.59,30.53 25.41,29.56 28.84,24.47 28.65,23.5 v25.34,21.26
  Bottom 0.127: C.54 32.44,35.03 v32.44,35.06 | v25.34,21.26 25.27,20.91 24.15,20.16 23.9,20.21 23.75,20.43 U6.2
N$127  (via drill 0.25)
  Top 0.127: v30.21,34.02 25.21,30.64 25.02,29.67 28.35,24.75 28.16,23.78 v25.37,21.9
  Bottom 0.127: C.55 30.27,34.05 v30.21,34.02 | v25.37,21.9 24.84,21.54 24.81,21.39 U6.16
N$128  (via drill 0.25)
  Top 0.127: v32.02,35.69 30.32,34.55 30.14,34.58 29.82,34.37 29.66,34.04 24.82,30.78 24.63,29.8 27.85,25.03 27.66,24.06 v24.66,22.03
  Bottom 0.127: C.56 32.01,35.71 v32.02,35.69 | U6.15 24.61,21.73 v24.66,22.03
N$129  (via drill 0.25)
  Top 0.127: v29.38,34.45 24.33,31.05 24.14,30.07 27.29,25.41 27.1,24.44 v24.73,22.84
  Bottom 0.127: C.57 29.4,34.43 v29.38,34.45 | U6.13 24.55,22.66 v24.73,22.84
N$130  (via drill 0.25)
  Top 0.127: v31.55,36.38 29.85,35.23 29.82,35.05 29.56,34.88 29.18,34.87 23.86,31.28 23.68,30.31 26.79,25.69 26.6,24.72 24.09,23.02 v24.05,22.85
  Bottom 0.127: C.58 v31.56,36.37 v31.55,36.38 | 23.16,22 U6.12 23.2,22.12 24.02,22.67 v24.05,22.85
N$131  (via drill 0.25)
  Top 0.127: v29.33,35.33 23.48,31.39 23.29,30.42 26.3,25.97 26.11,25 23.44,23.2 v23.35,22.74
  Bottom 0.127: C.59 29.32,35.34 v29.33,35.33 | v23.35,22.74 22.41,22.11 22.34,21.77 U6.10
N$132  (via drill 0.25)
  Top 0.127: v31.13,37.01 29.43,35.86 29.25,35.9 28.99,35.72 28.83,35.39 23.09,31.52 22.9,30.55 25.86,26.16 25.67,25.19 23.62,23.81 22.73,23.21 v22.65,22.79
  Bottom 0.127: C.60 31.11,37.03 v31.13,37.01 | v22.65,22.79 22.19,22.48 22.01,21.55 U6.9
N$133  (via drill 0.25)
  Top 0.127: v28.48,35.79 22.59,31.81 22.4,30.84 25.49,26.26 25.3,25.29 v21.67,22.84
  Bottom 0.127: C.61 28.54,35.78 v28.48,35.79 | U5.3 21.61,22.85 v21.67,22.84
N$134  (via drill 0.25)
  Top 0.127: v30.65,37.71 28.95,36.57 28.92,36.39 28.66,36.21 28.28,36.2 22.12,32.05 21.93,31.08 24.92,26.65 24.73,25.68 v23.1,24.58
  Bottom 0.127: C.62 30.65,37.69 v30.65,37.71 | U5.2 21.51,23.75 21.67,23.52 21.92,23.47 23.03,24.22 v23.1,24.58
N$135  (via drill 0.25)
  Top 0.127: v28.42,36.67 21.74,32.16 21.55,31.19 24.43,26.93 24.24,25.96 v23.13,25.21
  Bottom 0.127: C.63 28.48,36.71 v28.42,36.67 | v23.13,25.21 22.61,24.86 22.58,24.71 U5.16
N$136  (via drill 0.25)
  Top 0.127: v30.23,38.35 28.53,37.2 28.35,37.23 28.03,37.02 27.87,36.7 21.34,32.29 21.16,31.32 23.93,27.21 23.74,26.24 v22.43,25.35
  Bottom 0.127: C.64 30.22,38.36 v30.23,38.35 | U5.15 22.37,25.05 v22.43,25.35
N$137  (via drill 0.25)
  Top 0.127: v27.59,37.11 20.86,32.56 20.67,31.59 23.36,27.59 23.18,26.62 v22.49,26.16
  Bottom 0.127: C.65 27.61,37.08 v27.59,37.11 | U5.13 22.31,25.97 v22.49,26.16
N$138  (via drill 0.25)
  Top 0.127: v29.45,38.82 28.07,37.88 28.03,37.71 27.77,37.53 27.39,37.52 20.39,32.8 20.2,31.83 22.87,27.87 22.68,26.9 21.85,26.34 v21.82,26.16
  Bottom 0.127: C.66 v29.45,38.81 v29.45,38.82 | 20.92,25.31 U5.12 20.96,25.43 21.78,25.99 v21.82,26.16
N$139  (via drill 0.25)
  Top 0.127: v27.54,37.99 20.01,32.91 19.82,31.94 22.38,28.15 22.19,27.18 21.2,26.51 v21.11,26.06
  Bottom 0.127: C.67 v27.53,38 v27.54,37.99 | v21.11,26.06 20.17,25.42 20.11,25.08 U5.10
N$140  (via drill 0.25)
  Top 0.127: v29.02,39.45 27.64,38.52 27.46,38.55 27.2,38.37 27.04,38.05 19.61,33.04 19.43,32.07 21.94,28.34 21.75,27.37 20.5,26.53 v20.41,26.11
  Bottom 0.127: C.68 29.01,39.47 v29.02,39.45 | v20.41,26.11 19.95,25.79 19.77,24.87 U5.9
N$262
  Bottom 0.127: 41.22,53.96 40.4,55.17 40.59,56.14 46.85,60.36 47.04,61.33 42.73,67.73
N$263
  Bottom 0.127: 40.89,53.73 39.93,55.15 40.12,56.12 45.86,59.99 46.04,60.97 41.45,67.77 41.52,68.12 42,68.45
N$264
  Bottom 0.127: 40.56,53.51 39.46,55.14 39.65,56.11 45.5,60.06 45.69,61.03 41.02,67.96 41.09,68.31 41.78,68.78
N$265
  Bottom 0.127: 40.22,53.29 38.98,55.13 39.17,56.1 45.05,60.06 45.23,61.03 40.48,68.08 40.13,68.15 39.57,67.77
N$266
  Bottom 0.127: 39.89,53.06 38.51,55.11 38.7,56.09 44.69,60.13 44.88,61.1 40.49,67.61 40.14,67.67 39.79,67.44
N$267
  Bottom 0.127: 39.56,52.84 38.04,55.1 38.22,56.07 44.34,60.2 44.53,61.17 40.73,66.8 40.38,66.87 40.24,66.77
N$268
  Bottom 0.127: 39.23,52.62 37.56,55.09 37.75,56.06 43.68,60.06 43.87,61.03 40.41,66.16
N$269
  Bottom 0.127: 38.9,52.39 37.09,55.07 37.28,56.05 42.88,59.82 43.06,60.79 39.74,65.72
N$270
  Bottom 0.127: 34.92,49.71 31.41,54.92 31.59,55.89 36.14,58.96 36.33,59.93 33.85,63.61 33.49,63.67 32.93,63.3
N$271
  Bottom 0.127: 34.59,49.48 30.93,54.9 31.12,55.88 35.79,59.02 35.98,60 33.86,63.13 33.51,63.2 33.16,62.96
N$272
  Bottom 0.127: 34.26,49.26 30.46,54.89 30.65,55.86 35.43,59.09 35.62,60.06 34.1,62.33 33.74,62.39 33.6,62.3
N$273
  Bottom 0.127: 33.92,49.04 29.98,54.88 30.17,55.85 34.78,58.95 34.96,59.93 33.77,61.69
N$274
  Bottom 0.127: 33.59,48.81 29.51,54.86 29.7,55.84 33.97,58.72 34.16,59.69 33.11,61.24
N$275
  Bottom 0.127: 33.26,48.59 29.04,54.85 29.23,55.82 33.5,58.7 33.69,59.68 32.78,61.02
N$276
  Bottom 0.127: 32.93,48.37 28.56,54.84 28.75,55.81 32.66,58.44 32.84,59.41 31.66,61.17 31.73,61.52 32.05,61.74
N$277
  Bottom 0.127: 32.6,48.14 28.09,54.83 28.28,55.8 32.3,58.51 32.49,59.48 31.23,61.36 31.3,61.71 31.83,62.07 31.43,61.8
N$278
  Bottom 0.127: 37.57,51.5 35.19,55.02 35.38,55.99 40.65,59.54 40.83,60.51 37.22,65.88 36.86,65.95 36.25,65.53
N$279
  Bottom 0.127: 37.24,51.27 34.72,55.01 34.91,55.98 40.29,59.61 40.48,60.58 37.23,65.4 36.88,65.47 36.47,65.2
N$280
  Bottom 0.127: 36.91,51.05 34.25,55 34.44,55.97 39.94,59.68 40.13,60.65 37.47,64.6 37.11,64.67
N$281
  Bottom 0.127: 36.58,50.83 33.77,54.98 33.96,55.95 39.23,59.51 39.42,60.48 37.09,63.93
N$282
  Bottom 0.127: 36.25,50.6 33.3,54.97 33.49,55.94 38.42,59.27 38.61,60.24 36.43,63.48
N$283
  Bottom 0.127: 35.91,50.38 32.83,54.96 33.01,55.93 37.95,59.26 38.14,60.23 36.1,63.26
N$284
  Bottom 0.127: 35.58,50.16 32.35,54.94 32.54,55.92 37.06,58.96 37.24,59.93 34.93,63.37 34.99,63.72 35.37,63.97
N$285
  Bottom 0.127: 35.25,49.93 31.88,54.93 32.07,55.9 36.7,59.03 36.89,60 34.49,63.56 34.56,63.91 35.15,64.31
N$286
  Bottom 0.127: 38.57,52.17 36.62,55.06 36.8,56.03 42.4,59.81 42.59,60.78 39.41,65.49
N$287
  Bottom 0.127: 38.23,51.94 36.14,55.05 36.33,56.02 41.46,59.48 41.64,60.45 38.19,65.57 38.26,65.92 38.69,66.21
N$288
  Bottom 0.127: 37.9,51.72 35.67,55.04 35.86,56.01 41.1,59.55 41.29,60.52 37.76,65.76 37.82,66.11 38.46,66.54
N$289  (via drill 0.25)
  Top 0.127: v32.83,47.15 32.26,47.99 31.29,48.18 24.72,43.75 23.75,43.94 v17.9,52.62
  Bottom 0.127: 33.57,45.98 32.82,47.1 v32.83,47.15 | 18.57,53.12 17.91,52.68 v17.9,52.62
N$290  (via drill 0.25)
  Top 0.127: v34.76,44.98 33.61,46.68 33.43,46.71 33.25,46.98 33.25,47.35 32.5,48.46 31.53,48.65 25.11,44.32 24.14,44.5 v19.63,51.19
  Bottom 0.127: 33.91,46.2 34.73,44.98 v34.76,44.98 | 18.79,52.79 18.8,52.77 18.57,52.62 18.52,52.37 19.28,51.26 v19.63,51.19
N$291  (via drill 0.25)
  Top 0.127: v33.71,47.21 32.61,48.84 31.64,49.03 25.39,44.81 24.42,45 v20.26,51.16
  Bottom 0.127: 34.24,46.43 33.75,47.15 v33.71,47.21 | v20.26,51.16 19.91,51.68 19.76,51.71 19.51,52.07
N$292  (via drill 0.25)
  Top 0.127: v35.39,45.4 34.24,47.1 34.27,47.28 34.06,47.6 33.74,47.76 32.74,49.23 31.77,49.42 25.67,45.3 24.7,45.49 v20.4,51.86
  Bottom 0.127: 34.57,46.65 35.4,45.41 v35.39,45.4 | 19.85,52.3 20.1,51.92 v20.4,51.86
N$293  (via drill 0.25)
  Top 0.127: v34.15,48.04 33.01,49.72 32.04,49.91 26.05,45.87 25.08,46.06 v21.21,51.8
  Bottom 0.127: 34.9,46.87 34.13,48.02 v34.15,48.04 | 20.51,52.74 21.03,51.98 v21.21,51.8
N$294  (via drill 0.25)
  Top 0.127: v35.03,48.09 33.36,50.57 32.39,50.76 26.61,46.86 25.64,47.05 21.57,53.09 v21.11,53.17
  Bottom 0.127: 35.56,47.32 35.04,48.1 v35.03,48.09 | v21.11,53.17 20.47,54.12 20.14,54.18 19.89,54.02
N$295  (via drill 0.25)
  Top 0.127: v36.7,46.29 35.56,47.99 35.59,48.17 35.41,48.43 35.09,48.59 33.49,50.96 32.52,51.15 26.81,47.3 25.83,47.49 21.58,53.79 v21.16,53.87
  Bottom 0.127: 35.9,47.54 36.73,46.31 v36.7,46.29 | v21.16,53.87 20.85,54.34 19.92,54.52 19.67,54.35
N$296  (via drill 0.25)
  Top 0.127: v35.48,48.94 33.78,51.46 32.81,51.65 27.22,47.88 25.72,48.17 v21.21,54.86
  Bottom 0.127: 36.23,47.77 35.47,48.89 v35.48,48.94 | 21.88,55.36 21.22,54.91 v21.21,54.86
N$297  (via drill 0.25)
  Top 0.127: v37.41,46.77 36.26,48.47 36.09,48.5 35.91,48.76 35.9,49.14 34.01,51.94 33.06,52.13 27.29,48.24 26.32,48.43 v22.94,53.43
  Bottom 0.127: 36.56,47.99 37.38,46.77 v37.41,46.77 | 22.11,55.03 22.12,55.01 21.89,54.86 21.84,54.61 22.59,53.49 v22.94,53.43
N$298  (via drill 0.25)
  Top 0.127: v36.36,49 34.13,52.31 33.16,52.5 27.57,48.73 26.6,48.92 v23.58,53.39
  Bottom 0.127: 36.89,48.22 36.4,48.94 v36.36,49 | v23.58,53.39 23.22,53.92 23.07,53.95 22.83,54.31
N$299  (via drill 0.25)
  Top 0.127: v38.04,47.19 36.89,48.89 36.93,49.07 36.71,49.39 36.39,49.55 34.26,52.71 33.29,52.9 27.85,49.23 26.88,49.41 v23.72,54.1
  Bottom 0.127: 37.22,48.44 38.06,47.2 v38.04,47.19 | 23.16,54.53 23.42,54.16 v23.72,54.1
N$300  (via drill 0.25)
  Top 0.127: v36.8,49.83 34.53,53.19 33.56,53.38 28.23,49.79 27.26,49.98 v24.53,54.03
  Bottom 0.127: 37.55,48.66 36.78,49.81 v36.8,49.83 | 23.83,54.98 24.34,54.21 v24.53,54.03
N$301  (via drill 0.25)
  Top 0.127: v38.72,47.65 37.58,49.35 37.4,49.39 37.22,49.65 37.21,50.03 34.77,53.66 33.79,53.85 28.51,50.29 27.54,50.47 24.71,54.67 v24.53,54.71
  Bottom 0.127: 37.89,48.89 v38.72,47.65 | 23.68,55.61 23.66,55.59 23.8,55.56 24.35,54.74 v24.53,54.71
N$302  (via drill 0.25)
  Top 0.127: v37.68,49.88 34.88,54.04 33.9,54.23 28.79,50.78 27.82,50.97 24.88,55.32 v24.42,55.41
  Bottom 0.127: 38.22,49.11 v37.69,49.89 v37.68,49.88 | v24.42,55.41 23.79,56.35 23.45,56.42 23.21,56.25
N$303  (via drill 0.25)
  Top 0.127: v39.36,48.08 38.21,49.78 38.24,49.96 38.07,50.22 37.74,50.38 35.01,54.44 34.04,54.63 28.98,51.22 28.01,51.41 24.9,56.03 v24.47,56.11
  Bottom 0.127: 38.55,49.33 39.38,48.1 v39.36,48.08 | v24.47,56.11 24.16,56.57 23.23,56.75 22.98,56.58
N$304  (via drill 0.25)
  Top 0.127: v38.14,50.73 35.3,54.94 34.33,55.13 29.08,51.59 28.11,51.78 24.56,57.04 24.58,57.13 v24.63,57.17
  Bottom 0.127: 38.88,49.56 38.13,50.67 v38.14,50.73 | 25.2,57.6 24.64,57.22 v24.63,57.17
N$305  (via drill 0.25)
  Top 0.127: v40.06,48.56 38.91,50.26 38.74,50.29 38.56,50.55 38.55,50.93 35.53,55.4 34.56,55.59 29.47,52.16 28.5,52.35 v26.26,55.66
  Bottom 0.127: 39.21,49.78 40.03,48.56 v40.06,48.56 | 25.43,57.25 25.21,57.09 25.16,56.85 25.91,55.73 v26.26,55.66
N$306  (via drill 0.25)
  Top 0.127: v39.02,50.79 35.64,55.79 34.67,55.97 29.75,52.65 28.78,52.84 v26.9,55.63
  Bottom 0.127: 39.54,50 39.05,50.73 v39.02,50.79 | v26.9,55.63 26.54,56.16 26.39,56.19 26.15,56.55
N$307  (via drill 0.25)
  Top 0.127: v40.69,48.98 39.55,50.68 39.58,50.86 39.37,51.17 39.04,51.34 35.78,56.18 34.8,56.37 30.03,53.15 29.06,53.34 v27.03,56.34
  Bottom 0.127: 39.87,50.23 40.71,48.99 v40.69,48.98 | 26.48,56.77 26.73,56.39 v27.03,56.34
N$308  (via drill 0.25)
  Top 0.127: v39.45,51.62 36.05,56.67 35.07,56.86 30.41,53.71 29.44,53.9 v27.84,56.27
  Bottom 0.127: 40.21,50.45 39.43,51.6 v39.45,51.62 | 27.14,57.22 27.66,56.45 v27.84,56.27
N$309  (via drill 0.25)
  Top 0.127: v41.38,49.44 40.23,51.14 40.05,51.18 39.88,51.44 39.87,51.82 36.28,57.13 35.31,57.32 30.69,54.21 29.72,54.4 28.02,56.91 v27.85,56.95
  Bottom 0.127: 40.54,50.68 v41.37,49.44 v41.38,49.44 | 27,57.84 26.97,57.83 27.12,57.8 27.67,56.98 v27.85,56.95
N$310  (via drill 0.25)
  Top 0.127: v40.33,51.67 36.39,57.52 35.42,57.7 30.97,54.7 30,54.89 28.2,57.56 v27.74,57.65
  Bottom 0.127: 40.87,50.9 40.34,51.68 v40.33,51.67 | v27.74,57.65 27.11,58.59 26.77,58.65 26.52,58.49
N$311  (via drill 0.25)
  Top 0.127: v42.01,49.87 40.86,51.57 40.9,51.75 40.72,52.01 40.39,52.17 36.52,57.91 35.55,58.1 31.16,55.14 30.19,55.33 28.81,57.38 28.21,58.27 v27.79,58.35
  Bottom 0.127: 41.2,51.12 42.03,49.89 v42.01,49.87 | v27.79,58.35 27.48,58.81 26.55,58.99 26.3,58.82
N$312  (via drill 0.25)
  Top 0.127: v40.79,52.52 36.81,58.41 35.84,58.6 31.26,55.51 30.29,55.7 v27.84,59.33
  Bottom 0.127: 41.53,51.35 40.78,52.46 v40.79,52.52 | 28.51,59.83 27.85,59.39 v27.84,59.33
N$313  (via drill 0.25)
  Top 0.127: v42.71,50.35 41.57,52.05 41.39,52.08 41.21,52.34 41.2,52.72 37.05,58.88 36.08,59.07 31.65,56.08 30.68,56.27 v29.58,57.9
  Bottom 0.127: 41.86,51.57 42.69,50.35 v42.71,50.35 | 28.74,59.5 28.75,59.48 28.52,59.33 28.47,59.08 29.22,57.97 v29.58,57.9
N$314  (via drill 0.25)
  Top 0.127: v41.67,52.57 37.16,59.26 36.19,59.45 31.93,56.57 30.96,56.76 v30.21,57.87
  Bottom 0.127: 42.2,51.79 41.71,52.52 v41.67,52.57 | v30.21,57.87 29.86,58.39 29.71,58.42 29.46,58.78
N$315  (via drill 0.25)
  Top 0.127: v43.35,50.77 42.2,52.47 42.23,52.65 42.02,52.96 41.7,53.13 37.29,59.65 36.32,59.84 32.21,57.07 31.24,57.26 v30.35,58.57
  Bottom 0.127: 42.53,52.02 43.36,50.78 v43.35,50.77 | 29.79,59.01 30.05,58.63 v30.35,58.57
N$316  (via drill 0.25)
  Top 0.127: v42.11,53.41 37.56,60.14 36.59,60.33 32.59,57.63 31.62,57.82 v31.16,58.51
  Bottom 0.127: 42.86,52.24 42.08,53.39 v42.11,53.41 | 30.46,59.45 30.97,58.69 v31.16,58.51
N$317  (via drill 0.25)
  Top 0.127: v43.82,51.55 42.88,52.93 42.71,52.97 42.53,53.23 42.52,53.61 37.8,60.61 36.83,60.8 32.87,58.13 31.9,58.32 31.34,59.15 v31.16,59.18
  Bottom 0.127: 43.19,52.47 v43.81,51.55 v43.82,51.55 | 30.31,60.08 30.29,60.06 30.43,60.04 30.99,59.22 v31.16,59.18
N$318  (via drill 0.25)
  Top 0.127: v42.99,53.46 37.91,60.99 36.94,61.18 33.15,58.62 32.18,58.81 31.51,59.8 v31.06,59.88
  Bottom 0.127: 43.52,52.69 v43,53.47 v42.99,53.46 | v31.06,59.88 30.42,60.83 30.08,60.89 29.84,60.73
N$319  (via drill 0.25)
  Top 0.127: v44.45,51.98 43.52,53.36 43.55,53.54 43.37,53.8 43.05,53.96 38.04,61.38 37.07,61.57 33.34,59.06 32.37,59.25 31.53,60.5 v31.11,60.58
  Bottom 0.127: 43.85,52.91 44.47,51.99 v44.45,51.98 | v31.11,60.58 30.79,61.05 29.87,61.23 29.62,61.06
N$320  (via drill 0.25)
  Top 0.127: v21.21,52.47 21.39,52.44 25.36,46.55 26.33,46.36 32.28,50.38 33.25,50.19 34.56,48.24 34.57,47.86 34.75,47.6 34.92,47.57 v36.07,45.87
  Bottom 0.127: 20.34,53.35 20.49,53.32 21.04,52.51 v21.21,52.47 | 35.23,47.1 v36.07,45.86 v36.07,45.87
N$321
  Bottom 0.127: 43.12,20.92 43.44,20.45 43.35,20.01 36.45,15.35 36.26,14.38 42.15,5.65 42.5,5.58 43.12,5.99
N$322
  Bottom 0.127: 43.45,21.15 43.8,20.63 43.66,19.91 36.8,15.28 36.61,14.31 42.14,6.12 42.49,6.05 42.89,6.33
N$323
  Bottom 0.127: 43.78,21.37 44.17,20.79 43.98,19.82 37.15,15.21 36.96,14.24 41.9,6.93 42.25,6.86 42.45,6.99
N$324
  Bottom 0.127: 44.12,21.59 44.65,20.81 44.46,19.83 37.87,15.39 37.68,14.42 42.28,7.6
N$325
  Bottom 0.127: 44.45,21.82 45.12,20.82 44.93,19.85 38.67,15.62 38.48,14.65 42.94,8.04
N$326
  Bottom 0.127: 44.78,22.04 45.59,20.83 45.41,19.86 39.14,15.64 38.96,14.67 43.27,8.27
N$327
  Bottom 0.127: 45.11,22.26 46.07,20.85 45.88,19.87 40.14,16.01 39.95,15.03 44.54,8.23 44.48,7.88 44,7.55
N$328
  Bottom 0.127: 45.44,22.49 46.54,20.86 46.35,19.89 40.5,15.94 40.31,14.96 44.98,8.04 44.91,7.69 44.22,7.22
N$329
  Bottom 0.127: 45.77,22.71 47.02,20.87 46.83,19.9 40.95,15.94 40.76,14.97 45.52,7.92 45.87,7.85 46.43,8.23
N$330
  Bottom 0.127: 46.11,22.94 47.49,20.89 47.3,19.91 41.31,15.87 41.12,14.9 45.51,8.39 45.86,8.32 46.21,8.56
N$331
  Bottom 0.127: 46.44,23.16 47.96,20.9 47.77,19.93 41.66,15.8 41.47,14.83 45.27,9.2 45.62,9.13 45.76,9.23
N$332
  Bottom 0.127: 46.77,23.38 48.44,20.91 48.25,19.94 42.32,15.94 42.13,14.97 45.59,9.83
N$333
  Bottom 0.127: 47.1,23.61 48.91,20.92 48.72,19.95 43.12,16.18 42.93,15.21 46.26,10.28
N$334
  Bottom 0.127: 51.08,26.29 54.59,21.08 54.41,20.11 49.86,17.04 49.67,16.07 52.15,12.39 52.5,12.33 53.07,12.7
N$335
  Bottom 0.127: 51.41,26.51 55.07,21.09 54.88,20.12 50.21,16.98 50.02,16 52.14,12.87 52.49,12.8 52.84,13.04
N$336
  Bottom 0.127: 51.74,26.74 55.54,21.11 55.35,20.14 50.56,16.91 50.38,15.94 51.9,13.67 52.25,13.6 52.39,13.7
N$337
  Bottom 0.127: 52.08,26.96 56.01,21.12 55.83,20.15 51.22,17.04 51.03,16.07 52.22,14.31
N$338
  Bottom 0.127: 52.41,27.19 56.49,21.13 56.3,20.16 52.03,17.28 51.84,16.31 52.89,14.76
N$339
  Bottom 0.127: 52.74,27.41 56.96,21.15 56.77,20.18 52.5,17.29 52.31,16.32 53.22,14.98
N$340
  Bottom 0.127: 53.07,27.63 57.44,21.16 57.25,20.19 53.34,17.56 53.15,16.58 54.34,14.83 54.27,14.48 53.94,14.26
N$341
  Bottom 0.127: 53.4,27.86 57.91,21.17 57.72,20.2 53.7,17.49 53.51,16.52 54.77,14.64 54.7,14.29 54.17,13.93 54.57,14.2
N$342
  Bottom 0.127: 48.43,24.5 50.8,20.98 50.62,20.01 45.35,16.46 45.17,15.48 48.78,10.12 49.14,10.05 49.75,10.47
N$343
  Bottom 0.127: 48.76,24.73 51.28,20.99 51.09,20.02 45.71,16.39 45.52,15.42 48.77,10.59 49.12,10.53 49.53,10.8
N$344
  Bottom 0.127: 49.09,24.95 51.75,21 51.56,20.03 46.06,16.32 45.87,15.35 48.53,11.4 48.89,11.33
N$345
  Bottom 0.127: 49.42,25.17 52.23,21.02 52.04,20.04 46.77,16.49 46.58,15.52 48.91,12.07
N$346
  Bottom 0.127: 49.75,25.4 52.7,21.03 52.51,20.06 47.58,16.73 47.39,15.76 49.57,12.52
N$347
  Bottom 0.127: 50.09,25.62 53.17,21.04 52.98,20.07 48.05,16.74 47.86,15.77 49.9,12.74
N$348
  Bottom 0.127: 50.42,25.84 53.65,21.06 53.46,20.08 48.94,17.04 48.75,16.07 51.07,12.63 51,12.28 50.63,12.02
N$349
  Bottom 0.127: 50.75,26.07 54.12,21.07 53.93,20.1 49.3,16.97 49.11,16 51.51,12.44 51.44,12.09 50.85,11.69
N$350
  Bottom 0.127: 47.43,23.83 49.38,20.94 49.19,19.97 43.6,16.19 43.41,15.22 46.59,10.51
N$351
  Bottom 0.127: 47.76,24.05 49.86,20.95 49.67,19.98 44.54,16.52 44.35,15.55 47.81,10.43 47.74,10.08 47.31,9.79
N$352
  Bottom 0.127: 48.1,24.28 50.33,20.96 50.14,19.99 44.9,16.45 44.71,15.48 48.24,10.24 48.17,9.89 47.54,9.46
N$353  (via drill 0.25)
  Top 0.127: v53.17,28.85 53.74,28.01 54.71,27.82 61.27,32.25 62.25,32.06 v68.1,23.38
  Bottom 0.127: 52.42,30.02 53.18,28.9 v53.17,28.85 | 67.43,22.88 68.09,23.32 v68.1,23.38
N$354  (via drill 0.25)
  Top 0.127: v51.24,31.02 52.39,29.32 52.57,29.29 52.74,29.02 52.75,28.65 53.5,27.54 54.47,27.35 60.89,31.68 61.86,31.49 v66.37,24.81
  Bottom 0.127: 52.09,29.8 51.27,31.02 v51.24,31.02 | 67.21,23.21 67.2,23.22 67.43,23.38 67.47,23.63 66.72,24.74 v66.37,24.81
N$355  (via drill 0.25)
  Top 0.127: v52.29,28.79 53.39,27.16 54.36,26.97 60.61,31.19 61.58,31 v65.74,24.84
  Bottom 0.127: 51.76,29.57 52.25,28.85 v52.29,28.79 | v65.74,24.84 66.09,24.32 66.24,24.29 66.48,23.93
N$356  (via drill 0.25)
  Top 0.127: v50.61,30.6 51.76,28.9 51.72,28.72 51.94,28.4 52.26,28.24 53.26,26.77 54.23,26.58 60.33,30.69 61.3,30.51 v65.6,24.14
  Bottom 0.127: 51.43,29.35 50.6,30.59 v50.61,30.6 | 66.15,23.7 65.9,24.08 v65.6,24.14
N$357  (via drill 0.25)
  Top 0.127: v51.85,27.96 52.99,26.28 53.96,26.09 59.95,30.13 60.92,29.94 v64.79,24.2
  Bottom 0.127: 51.1,29.13 51.87,27.98 v51.85,27.96 | 65.49,23.25 64.97,24.02 v64.79,24.2
N$358  (via drill 0.25)
  Top 0.127: v50.97,27.9 52.64,25.43 53.61,25.24 59.39,29.14 60.36,28.95 64.43,22.91 v64.89,22.82
  Bottom 0.127: 50.44,28.68 50.96,27.9 v50.97,27.9 | v64.89,22.82 65.53,21.88 65.86,21.82 66.11,21.98
N$359  (via drill 0.25)
  Top 0.127: v49.3,29.71 50.44,28.01 50.41,27.83 50.59,27.57 50.91,27.4 52.51,25.04 53.48,24.85 59.19,28.7 60.17,28.51 64.42,22.21 v64.84,22.13
  Bottom 0.127: 50.1,28.45 49.27,29.69 v49.3,29.71 | v64.84,22.13 65.15,21.66 66.08,21.48 66.33,21.65
N$360  (via drill 0.25)
  Top 0.127: v50.51,27.06 52.22,24.53 53.19,24.35 58.78,28.12 60.28,27.83 v64.79,21.14
  Bottom 0.127: 49.77,28.23 50.53,27.11 v50.51,27.06 | 64.12,20.64 64.78,21.09 v64.79,21.14
N$361  (via drill 0.25)
  Top 0.127: v48.59,29.23 49.74,27.53 49.91,27.5 50.09,27.23 50.1,26.86 51.99,24.06 52.94,23.87 58.71,27.76 59.68,27.57 v63.05,22.57
  Bottom 0.127: 49.44,28.01 48.62,29.23 v48.59,29.23 | 63.89,20.97 63.88,20.99 64.11,21.14 64.16,21.39 63.41,22.51 v63.05,22.57
N$362  (via drill 0.25)
  Top 0.127: v49.63,27 51.87,23.69 52.84,23.5 58.43,27.27 59.4,27.08 v62.42,22.61
  Bottom 0.127: 49.11,27.78 49.6,27.06 v49.63,27 | v62.42,22.61 62.77,22.08 62.92,22.05 63.17,21.69
N$363  (via drill 0.25)
  Top 0.127: v47.96,28.81 49.11,27.11 49.07,26.93 49.28,26.61 49.61,26.45 51.74,23.29 52.71,23.1 58.15,26.77 59.12,26.58 v62.28,21.9
  Bottom 0.127: 48.78,27.56 47.94,28.8 v47.96,28.81 | 62.84,21.47 62.58,21.84 v62.28,21.9
N$364  (via drill 0.25)
  Top 0.127: v49.2,26.17 51.47,22.8 52.44,22.62 57.77,26.21 58.74,26.02 v61.47,21.97
  Bottom 0.127: 48.45,27.34 49.22,26.19 v49.2,26.17 | 62.17,21.02 61.66,21.78 v61.47,21.97
N$365  (via drill 0.25)
  Top 0.127: v47.27,28.34 48.42,26.64 48.6,26.61 48.78,26.35 48.78,25.97 51.23,22.34 52.21,22.15 57.49,25.71 58.46,25.52 61.29,21.32 v61.47,21.29
  Bottom 0.127: 48.11,27.11 v47.28,28.35 v47.27,28.34 | 62.32,20.39 62.34,20.41 62.2,20.44 61.64,21.26 v61.47,21.29
N$366  (via drill 0.25)
  Top 0.127: v48.32,26.12 51.12,21.96 52.09,21.77 57.21,25.22 58.18,25.03 61.12,20.68 v61.57,20.59
  Bottom 0.127: 47.78,26.89 v48.31,26.11 v48.32,26.12 | v61.57,20.59 62.21,19.65 62.55,19.58 62.79,19.75
N$367  (via drill 0.25)
  Top 0.127: v46.64,27.92 47.79,26.22 47.76,26.04 47.93,25.78 48.26,25.61 50.99,21.56 51.96,21.37 57.01,24.78 57.99,24.59 61.1,19.97 v61.53,19.89
  Bottom 0.127: 47.45,26.67 46.62,27.9 v46.64,27.92 | v61.53,19.89 61.84,19.43 62.76,19.25 63.01,19.41
N$368  (via drill 0.25)
  Top 0.127: v47.86,25.27 50.7,21.06 51.67,20.87 56.91,24.41 57.96,24.11 61.44,18.95 61.42,18.87 v61.37,18.83
  Bottom 0.127: 47.12,26.44 47.87,25.32 v47.86,25.27 | 60.8,18.4 61.36,18.78 v61.37,18.83
N$369  (via drill 0.25)
  Top 0.127: v45.94,27.44 47.08,25.74 47.26,25.71 47.44,25.44 47.45,25.07 50.46,20.59 51.44,20.41 56.53,23.84 57.5,23.65 v59.74,20.34
  Bottom 0.127: 46.79,26.22 45.96,27.44 v45.94,27.44 | 60.57,18.75 60.79,18.9 60.84,19.15 60.09,20.27 v59.74,20.34
N$370  (via drill 0.25)
  Top 0.127: v46.98,25.21 50.35,20.21 51.33,20.02 56.25,23.35 57.22,23.16 v59.1,20.37
  Bottom 0.127: 46.46,25.99 46.95,25.27 v46.98,25.21 | v59.1,20.37 59.46,19.84 59.61,19.81 59.85,19.45
N$371  (via drill 0.25)
  Top 0.127: v45.31,27.02 46.45,25.32 46.42,25.14 46.63,24.82 46.96,24.66 50.22,19.82 51.19,19.63 55.97,22.85 56.94,22.66 v58.97,19.66
  Bottom 0.127: 46.12,25.77 45.29,27.01 v45.31,27.02 | 59.52,19.23 59.27,19.61 v58.97,19.66
N$372  (via drill 0.25)
  Top 0.127: v46.55,24.38 49.95,19.33 50.93,19.14 55.59,22.29 56.56,22.1 v58.16,19.73
  Bottom 0.127: 45.79,25.55 46.57,24.4 v46.55,24.38 | 58.86,18.78 58.34,19.55 v58.16,19.73
N$373  (via drill 0.25)
  Top 0.127: v44.62,26.55 45.77,24.85 45.94,24.82 46.12,24.56 46.13,24.18 49.72,18.86 50.69,18.68 55.31,21.79 56.28,21.6 57.98,19.09 v58.15,19.05
  Bottom 0.127: 45.46,25.32 v44.63,26.56 v44.62,26.55 | 59,18.16 59.03,18.17 58.88,18.2 58.33,19.02 v58.15,19.05
N$374  (via drill 0.25)
  Top 0.127: v45.67,24.33 49.61,18.48 50.58,18.29 55.03,21.3 56,21.11 57.8,18.44 v58.26,18.35
  Bottom 0.127: 45.13,25.1 45.66,24.32 v45.67,24.33 | v58.26,18.35 58.89,17.41 59.23,17.34 59.47,17.51
N$375  (via drill 0.25)
  Top 0.127: v43.99,26.13 45.14,24.43 45.1,24.25 45.28,23.99 45.6,23.83 49.47,18.09 50.45,17.9 54.83,20.86 55.81,20.67 57.19,18.62 57.79,17.73 v58.21,17.65
  Bottom 0.127: 44.8,24.88 43.96,26.11 v43.99,26.13 | v58.21,17.65 58.52,17.19 59.45,17.01 59.7,17.18
N$376  (via drill 0.25)
  Top 0.127: v45.21,23.48 49.19,17.59 50.16,17.4 54.73,20.49 55.71,20.3 v58.16,16.67
  Bottom 0.127: 44.47,24.65 45.22,23.54 v45.21,23.48 | 57.48,16.17 58.15,16.61 v58.16,16.67
N$377  (via drill 0.25)
  Top 0.127: v43.28,25.65 44.43,23.95 44.61,23.92 44.79,23.66 44.79,23.28 48.95,17.12 49.92,16.93 54.35,19.92 55.32,19.73 v56.42,18.1
  Bottom 0.127: 44.13,24.43 43.31,25.65 v43.28,25.65 | 57.26,16.5 57.25,16.51 57.48,16.67 57.53,16.92 56.77,18.03 v56.42,18.1
N$378  (via drill 0.25)
  Top 0.127: v44.33,23.42 48.84,16.74 49.81,16.55 54.07,19.43 55.04,19.24 v55.79,18.13
  Bottom 0.127: 43.8,24.2 44.29,23.48 v44.33,23.42 | v55.79,18.13 56.14,17.61 56.29,17.58 56.54,17.22
N$379  (via drill 0.25)
  Top 0.127: v42.65,25.23 43.8,23.53 43.77,23.35 43.98,23.03 44.3,22.87 48.71,16.34 49.68,16.16 53.79,18.93 54.76,18.74 v55.65,17.43
  Bottom 0.127: 43.47,23.98 42.64,25.22 v42.65,25.23 | 56.2,16.99 55.95,17.37 v55.65,17.43
N$380  (via drill 0.25)
  Top 0.127: v43.89,22.59 48.44,15.86 49.41,15.67 53.41,18.36 54.38,18.18 v54.84,17.49
  Bottom 0.127: 43.14,23.76 43.91,22.61 v43.89,22.59 | 55.54,16.54 55.02,17.31 v54.84,17.49
N$381  (via drill 0.25)
  Top 0.127: v42.18,24.45 43.12,23.07 43.29,23.03 43.47,22.77 43.48,22.39 48.2,15.39 49.17,15.2 53.13,17.87 54.1,17.68 54.66,16.85 v54.84,16.82
  Bottom 0.127: 42.81,23.53 v42.19,24.45 v42.18,24.45 | 55.69,15.92 55.71,15.94 55.56,15.96 55.01,16.78 v54.84,16.82
N$382  (via drill 0.25)
  Top 0.127: v43.01,22.54 48.09,15.01 49.06,14.82 52.85,17.38 53.82,17.19 54.48,16.2 v54.94,16.11
  Bottom 0.127: 42.48,23.31 v43,22.53 v43.01,22.54 | v54.94,16.11 55.58,15.17 55.91,15.11 56.16,15.27
N$383  (via drill 0.25)
  Top 0.127: v41.55,24.02 42.48,22.64 42.45,22.46 42.63,22.2 42.95,22.04 47.96,14.61 48.93,14.43 52.65,16.94 53.63,16.75 54.47,15.5 v54.89,15.41
  Bottom 0.127: 42.14,23.09 41.52,24.01 v41.55,24.02 | v54.89,15.41 55.21,14.95 56.13,14.77 56.38,14.94
N$384  (via drill 0.25)
  Top 0.127: v64.78,23.53 64.61,23.56 60.64,29.45 59.67,29.63 53.72,25.62 52.75,25.81 51.44,27.76 51.43,28.14 51.25,28.4 51.07,28.43 v49.93,30.13
  Bottom 0.127: 65.66,22.65 65.51,22.67 64.96,23.49 v64.78,23.53 | 50.77,28.9 v49.93,30.14 v49.93,30.13
N$385